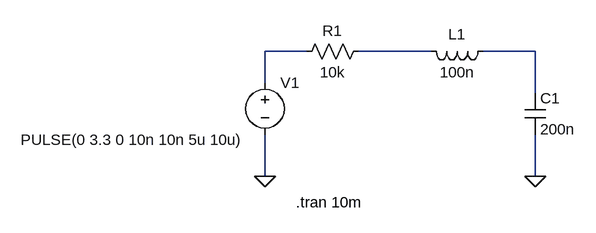
[diagram p0: schematic pwm-rlc-filter.asc]
pwm-rlc-filter.asc, the LTspice schematic file:
Version 4.1
SHEET 1 880 680
WIRE 112 80 48 80
WIRE 304 80 192 80
WIRE 464 80 384 80
WIRE 48 128 48 80
WIRE 464 144 464 80
WIRE 48 272 48 208
WIRE 464 272 464 208
FLAG 48 272 0
FLAG 464 272 0
SYMBOL res 208 64 R90
WINDOW 0 0 56 VBottom 2
WINDOW 3 32 56 VTop 2
SYMATTR InstName R1
SYMATTR Value 10k
SYMBOL cap 448 144 R0
SYMATTR InstName C1
SYMATTR Value 200n
SYMBOL voltage 48 112 R0
WINDOW 3 -376 104 Left 2
WINDOW 123 0 0 Left 0
WINDOW 39 0 0 Left 0
SYMATTR InstName V1
SYMATTR Value PULSE(0 3.3 0 10n 10n 5u 10u)
SYMBOL ind 400 64 R90
WINDOW 0 5 56 VBottom 2
WINDOW 3 32 56 VTop 2
SYMATTR InstName L1
SYMATTR Value 100n
SYMATTR SpiceLine Rser=1m
TEXT 96 312 Left 2 !.tran 10m

The netlist it stands for:
* pwm-rlc-filter.asc
R1 N002 N001 10k
C1 N003 0 200n
V1 N001 0 PULSE(0 3.3 0 10n 10n 5u 10u)
L1 N003 N002 100n Rser=1m
.tran 10m
.backanno
.end